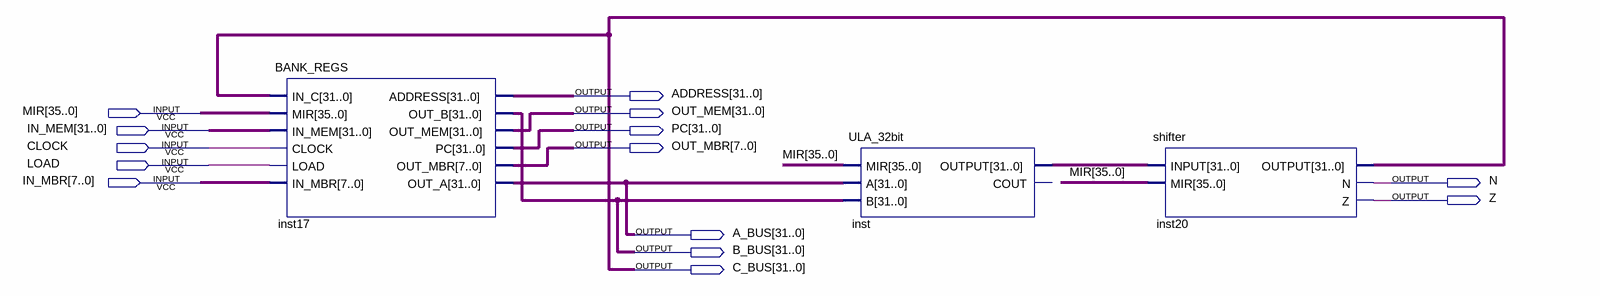
[diagram p0: schematic sheet]
// Quartus schematic DATA_PATH.bdf as structural Verilog: 3 symbols, 14 pins
module DATA_PATH (
  input  [35:0] MIR,
  input  [31:0] IN_MEM,
  input  CLOCK,
  input  LOAD,
  input  [7:0] IN_MBR,
  output [31:0] ADDRESS,
  output [31:0] OUT_MEM,
  output [31:0] PC,
  output [7:0] OUT_MBR,
  output N,
  output Z,
  output [31:0] A_BUS,
  output [31:0] B_BUS,
  output [31:0] C_BUS
);

  wire [31:0] inst_output;

  BANK_REGS inst17 (
    .IN_C(C_BUS), .MIR(MIR), .IN_MEM(IN_MEM), .CLOCK(CLOCK), .LOAD(LOAD), .IN_MBR(IN_MBR), .ADDRESS(ADDRESS),
    .OUT_B(B_BUS), .OUT_MEM(OUT_MEM), .PC(PC), .OUT_MBR(OUT_MBR), .OUT_A(A_BUS));
  ULA_32bit inst (.MIR(MIR), .A(A_BUS), .B(B_BUS), .OUTPUT(inst_output));  // open: COUT
  shifter inst20 (.INPUT(inst_output), .MIR(MIR), .OUTPUT(C_BUS), .N(N), .Z(Z));
endmodule
